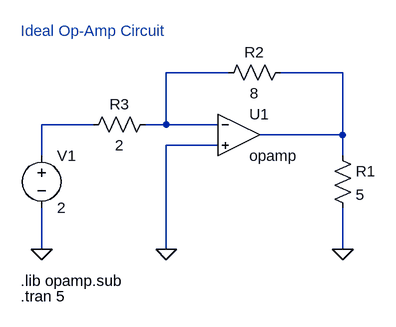
[diagram p0: schematic 01 Ideal Op Amps.asc]
01 Ideal Op Amps.asc, the LTspice schematic file:
Version 4
SHEET 1 880 680
WIRE 240 64 144 64
WIRE 416 64 320 64
WIRE 32 144 -48 144
WIRE 144 144 144 64
WIRE 144 144 112 144
WIRE 224 144 144 144
WIRE 416 160 416 64
WIRE 416 160 288 160
WIRE 224 176 144 176
WIRE -48 192 -48 144
WIRE 416 192 416 160
WIRE -48 336 -48 272
WIRE 144 336 144 176
WIRE 416 336 416 272
FLAG 416 336 0
FLAG -48 336 0
FLAG 144 336 0
SYMBOL OpAmps\\opamp 256 96 R0
SYMATTR InstName U1
SYMBOL res 400 176 R0
SYMATTR InstName R1
SYMATTR Value 5
SYMBOL res 336 48 R90
WINDOW 0 0 56 VBottom 2
WINDOW 3 32 56 VTop 2
SYMATTR InstName R2
SYMATTR Value 8
SYMBOL res 128 128 R90
WINDOW 0 0 56 VBottom 2
WINDOW 3 32 56 VTop 2
SYMATTR InstName R3
SYMATTR Value 2
SYMBOL voltage -48 176 R0
WINDOW 123 0 0 Left 0
WINDOW 39 0 0 Left 0
SYMATTR InstName V1
SYMATTR Value 2
TEXT -80 384 Left 2 !.lib opamp.sub
TEXT -80 408 Left 2 !.tran 5
TEXT -80 0 Left 2 ;Ideal Op-Amp Circuit

The netlist it stands for:
* 01 Ideal Op Amps.asc
XU1 N001 0 N002 opamp Aol=100K GBW=10Meg  ; pins invin noninvin out
R1 N002 0 5
R2 N002 N001 8
R3 N001 N003 2
V1 N003 0 2
.lib opamp.sub
.tran 5
* Ideal Op-Amp Circuit
.backanno
.end